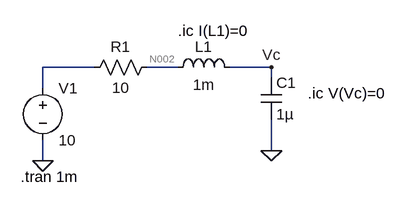
[diagram p0: schematic RLC_with_source.asc]
RLC_with_source.asc, the LTspice schematic file:
Version 4
SHEET 1 880 680
WIRE 64 144 -16 144
WIRE 192 144 144 144
WIRE 336 144 272 144
WIRE 336 160 336 144
WIRE -16 176 -16 144
WIRE 336 272 336 224
WIRE -16 288 -16 256
FLAG 336 272 0
FLAG -16 288 0
FLAG 336 144 Vc
SYMBOL voltage -16 160 R0
WINDOW 123 0 0 Left 0
WINDOW 39 0 0 Left 0
SYMATTR InstName V1
SYMATTR Value 10
SYMBOL res 160 128 R90
WINDOW 0 0 56 VBottom 2
WINDOW 3 32 56 VTop 2
SYMATTR InstName R1
SYMATTR Value 10
SYMBOL ind 176 160 R270
WINDOW 0 32 56 VTop 2
WINDOW 3 5 56 VBottom 2
SYMATTR InstName L1
SYMATTR Value 1m
SYMBOL cap 320 160 R0
SYMATTR InstName C1
SYMATTR Value 1µ
TEXT 192 88 Left 2 !.ic I(L1)=0
TEXT 392 184 Left 2 !.ic V(Vc)=0
TEXT -50 312 Left 2 !.tran 1m

The netlist it stands for:
* RLC_with_source.asc
V1 N001 0 10
R1 N002 N001 10
L1 N002 Vc 1m
C1 Vc 0 1µ
.ic I(L1)=0
.ic V(Vc)=0
.tran 1m
.backanno
.end

* Results of the author's LTspice run, read from the files saved beside the schematic
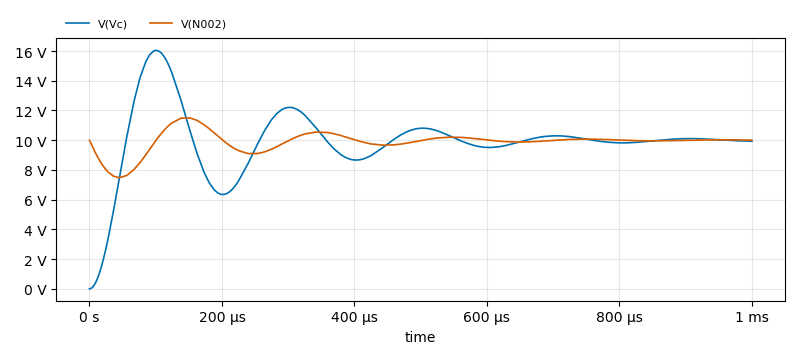
[diagram p1: Transient Analysis of RLC_with_source.asc, plotted from the saved traces]
* Transient Analysis, 1 run:
*   V(Vc): min 0 V, max 16.05 V, average 9.9 V, rms 10.18 V, last 9.936 V
*   V(N002): min 7.478 V, max 11.5 V, average 9.901 V, rms 9.925 V, last 10 V